# Altium schematic sheet XLAT AND JTAG.SchDoc
size A4
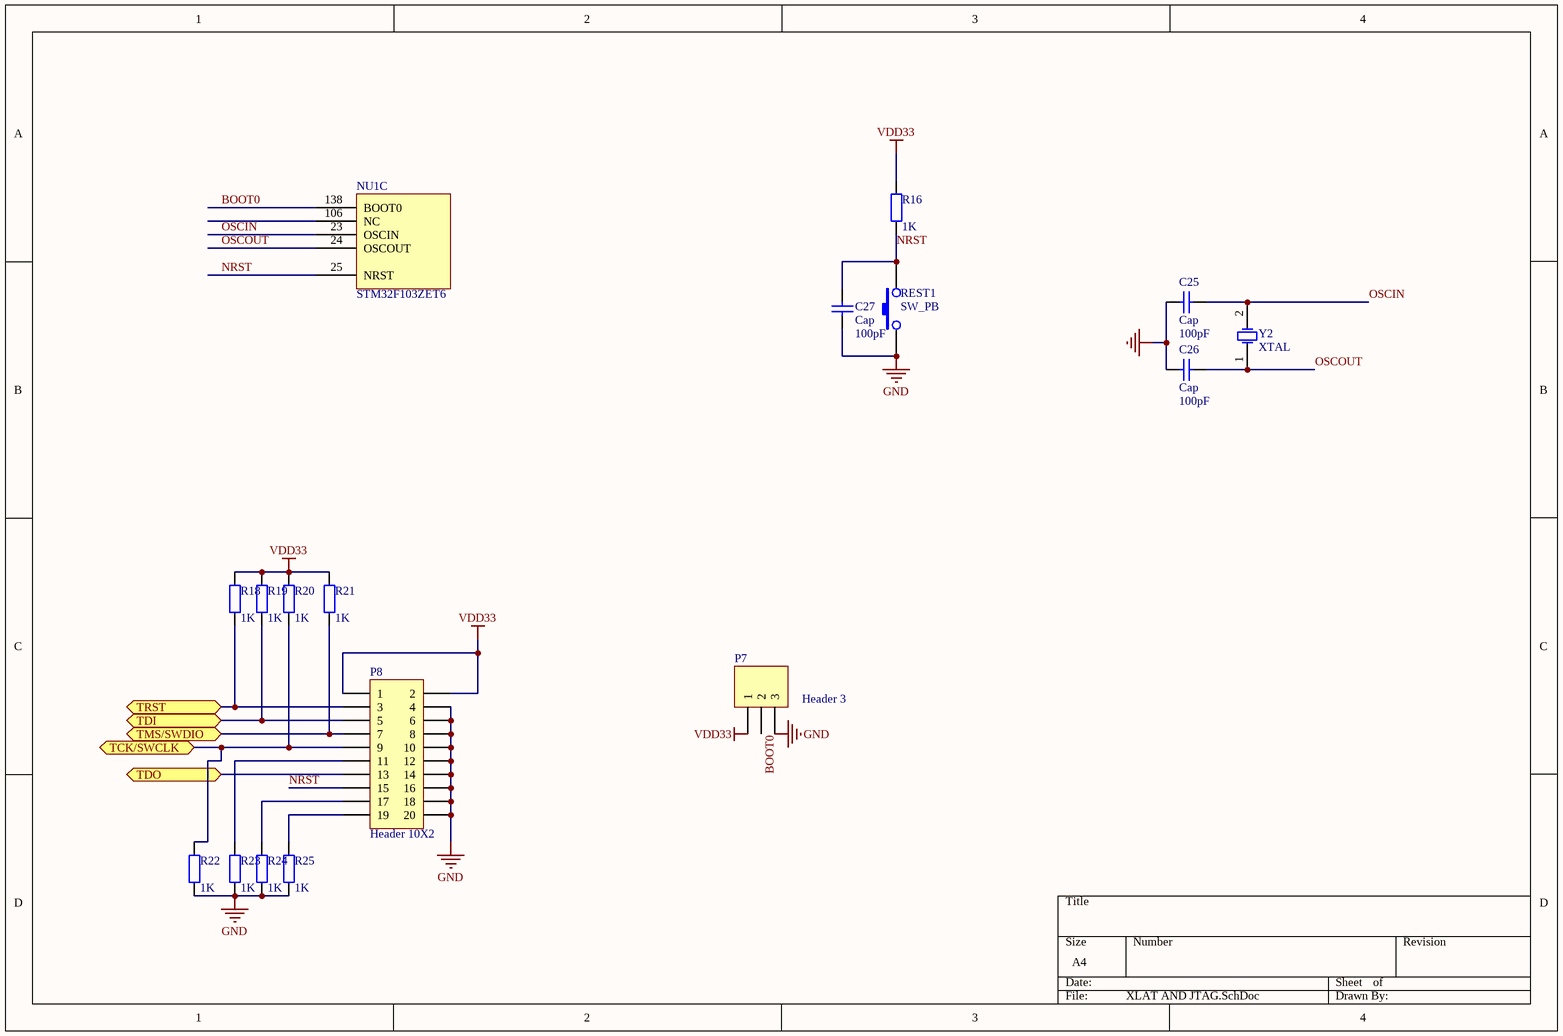
[diagram p0: XLAT AND JTAG.SchDoc]

## Parts
C25  Cap  value 100pF  [0805]
C26  Cap  value 100pF  [0805]
C27  Cap  value 100pF  [0805]
NU1  STM32F103ZET6  [LQFN144]  (part C of 3)
P7  Header 3  [HDR1X3]
P8  Header 10X2  [HDR2X10]
R16  value 1K  [0805]  (hidden comment: Res2)
R18  value 1K  [0805]  (hidden comment: Res2)
R19  value 1K  [0805]  (hidden comment: Res2)
R20  value 1K  [0805]  (hidden comment: Res2)
R21  value 1K  [0805]  (hidden comment: Res2)
R22  value 1K  [0805]  (hidden comment: Res2)
R23  value 1K  [0805]  (hidden comment: Res2)
R24  value 1K  [0805]  (hidden comment: Res2)
R25  value 1K  [0805]  (hidden comment: Res2)
REST1  SW_PB  [SWPB]
Y2  XTAL  [XTAL-1]

## Ports
TCK/SWCLK (bidir), TDI (bidir), TDO (bidir), TMS/SWDIO (bidir), TRST (bidir)

## Nets
GND: C25.1 C26.1 C27.1 P7.3 P8.4 P8.6 P8.8 P8.10 P8.12 P8.14 P8.16 P8.18 P8.20 R22.2 R23.2 R24.2 R25.2 REST1.1
VDD33: P7.1 P8.1 P8.2 R16.2 R18.2 R19.2 R20.2 R21.2
BOOT0: NU1.138(BOOT0) P7.2
NRST: C27.2 NU1.25(NRST) P8.15 R16.1 REST1.2
OSCIN: C25.2 NU1.23(OSCIN) Y2.2(OSC2)
OSCOUT: C26.2 NU1.24(OSCOUT) Y2.1(OSC1)
TCK/SWCLK: P8.9 R20.1 R22.1 ; port TCK/SWCLK
TDI: P8.5 R19.1 ; port TDI
TDO: P8.13 ; port TDO
TMS/SWDIO: P8.7 R21.1 ; port TMS/SWDIO
TRST: P8.3 R18.1 ; port TRST
NetP8_11: P8.11 R23.1
NetP8_17: P8.17 R24.1
NetP8_19: P8.19 R25.1

Not connected (* = marked no-connect by the designer): NU1 106(NC)

## Library data of the parts
C25-C27 = Cap: Capacitor; Published: 8-Jun-2000; LatestRevisionDate: 17-Jul-2002; LatestRevisionNote: Re-released for DXP Platform.; PackageReference: RAD-0.3; Publisher: Altium Limited
P7 = Header 3: Header, 3-Pin; LatestRevisionDate: 17-Jul-2002; LatestRevisionNote: Re-released for DXP Platform.; Publisher: Altium Limited
P8 = Header 10X2: Header, 10-Pin, Dual row; LatestRevisionDate: 17-Jul-2002; LatestRevisionNote: Re-released for DXP Platform.; Publisher: Altium Limited
R16 R18-R25 = Res2: Resistor; Published: 8-Jun-2000; LatestRevisionDate: 17-Jul-2002; LatestRevisionNote: Re-released for DXP Platform.; PackageReference: AXIAL-0.4; Publisher: Altium Limited
Y2 = XTAL: Crystal Oscillator; Published: 8-Jun-2000; LatestRevisionDate: 17-Jul-2002; LatestRevisionNote: Re-released for DXP Platform.; PackageReference: R38; Publisher: Altium Limited